# Altium schematic sheet Sheet2.SchDoc
size A4
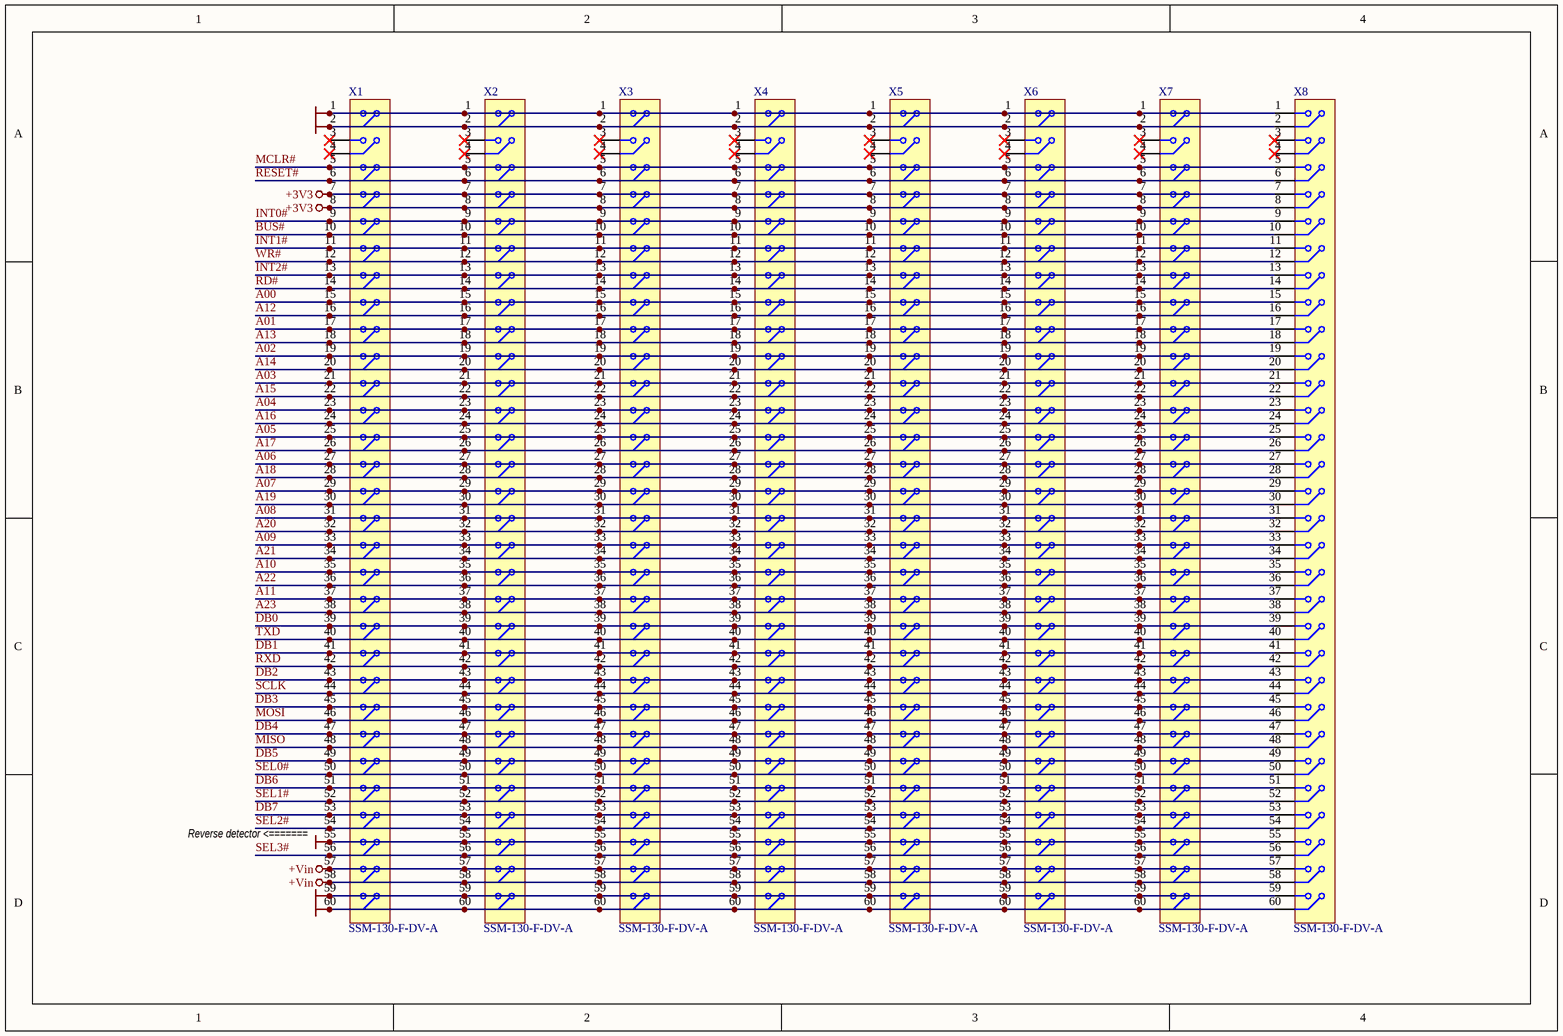
[diagram p0: Sheet2.SchDoc]

## Parts
X1  SSM-130-F-DV-A  [2015-2X30XD]
X2  SSM-130-F-DV-A  [2015-2X30XD]
X3  SSM-130-F-DV-A  [2015-2X30XD]
X4  SSM-130-F-DV-A  [2015-2X30XD]
X5  SSM-130-F-DV-A  [2015-2X30XD]
X6  SSM-130-F-DV-A  [2015-2X30XD]
X7  SSM-130-F-DV-A  [2015-2X30XD]
X8  SSM-130-F-DV-A  [2015-2X30XD]

## Nets
+3V3: X1.7 X1.8 X2.7 X2.8 X3.7 X3.8 X4.7 X4.8 X5.7 X5.8 X6.7 X6.8 X7.7 X7.8 X8.7 X8.8
+Vin: X1.57 X1.58 X2.57 X2.58 X3.57 X3.58 X4.57 X4.58 X5.57 X5.58 X6.57 X6.58 X7.57 X7.58 X8.57 X8.58
GND: X1.1 X1.2 X1.55 X1.59 X1.60 X2.1 X2.2 X2.55 X2.59 X2.60 X3.1 X3.2 X3.55 X3.59 X3.60 X4.1 X4.2 X4.55 X4.59 X4.60 X5.1 X5.2 X5.55 X5.59 X5.60 X6.1 X6.2 X6.55 X6.59 X6.60 X7.1 X7.2 X7.55 X7.59 X7.60 X8.1 X8.2 X8.55 X8.59 X8.60
A00: X1.15 X2.15 X3.15 X4.15 X5.15 X6.15 X7.15 X8.15
A01: X1.17 X2.17 X3.17 X4.17 X5.17 X6.17 X7.17 X8.17
A02: X1.19 X2.19 X3.19 X4.19 X5.19 X6.19 X7.19 X8.19
A03: X1.21 X2.21 X3.21 X4.21 X5.21 X6.21 X7.21 X8.21
A04: X1.23 X2.23 X3.23 X4.23 X5.23 X6.23 X7.23 X8.23
A05: X1.25 X2.25 X3.25 X4.25 X5.25 X6.25 X7.25 X8.25
A06: X1.27 X2.27 X3.27 X4.27 X5.27 X6.27 X7.27 X8.27
A07: X1.29 X2.29 X3.29 X4.29 X5.29 X6.29 X7.29 X8.29
A08: X1.31 X2.31 X3.31 X4.31 X5.31 X6.31 X7.31 X8.31
A09: X1.33 X2.33 X3.33 X4.33 X5.33 X6.33 X7.33 X8.33
A10: X1.35 X2.35 X3.35 X4.35 X5.35 X6.35 X7.35 X8.35
A11: X1.37 X2.37 X3.37 X4.37 X5.37 X6.37 X7.37 X8.37
A12: X1.16 X2.16 X3.16 X4.16 X5.16 X6.16 X7.16 X8.16
A13: X1.18 X2.18 X3.18 X4.18 X5.18 X6.18 X7.18 X8.18
A14: X1.20 X2.20 X3.20 X4.20 X5.20 X6.20 X7.20 X8.20
A15: X1.22 X2.22 X3.22 X4.22 X5.22 X6.22 X7.22 X8.22
A16: X1.24 X2.24 X3.24 X4.24 X5.24 X6.24 X7.24 X8.24
A17: X1.26 X2.26 X3.26 X4.26 X5.26 X6.26 X7.26 X8.26
A18: X1.28 X2.28 X3.28 X4.28 X5.28 X6.28 X7.28 X8.28
A19: X1.30 X2.30 X3.30 X4.30 X5.30 X6.30 X7.30 X8.30
A20: X1.32 X2.32 X3.32 X4.32 X5.32 X6.32 X7.32 X8.32
A21: X1.34 X2.34 X3.34 X4.34 X5.34 X6.34 X7.34 X8.34
A22: X1.36 X2.36 X3.36 X4.36 X5.36 X6.36 X7.36 X8.36
A23: X1.38 X2.38 X3.38 X4.38 X5.38 X6.38 X7.38 X8.38
BUS#: X1.10 X2.10 X3.10 X4.10 X5.10 X6.10 X7.10 X8.10
DB0: X1.39 X2.39 X3.39 X4.39 X5.39 X6.39 X7.39 X8.39
DB1: X1.41 X2.41 X3.41 X4.41 X5.41 X6.41 X7.41 X8.41
DB2: X1.43 X2.43 X3.43 X4.43 X5.43 X6.43 X7.43 X8.43
DB3: X1.45 X2.45 X3.45 X4.45 X5.45 X6.45 X7.45 X8.45
DB4: X1.47 X2.47 X3.47 X4.47 X5.47 X6.47 X7.47 X8.47
DB5: X1.49 X2.49 X3.49 X4.49 X5.49 X6.49 X7.49 X8.49
DB6: X1.51 X2.51 X3.51 X4.51 X5.51 X6.51 X7.51 X8.51
DB7: X1.53 X2.53 X3.53 X4.53 X5.53 X6.53 X7.53 X8.53
INT0#: X1.9 X2.9 X3.9 X4.9 X5.9 X6.9 X7.9 X8.9
INT1#: X1.11 X2.11 X3.11 X4.11 X5.11 X6.11 X7.11 X8.11
INT2#: X1.13 X2.13 X3.13 X4.13 X5.13 X6.13 X7.13 X8.13
MCLR#: X1.5 X2.5 X3.5 X4.5 X5.5 X6.5 X7.5 X8.5
MISO: X1.48 X2.48 X3.48 X4.48 X5.48 X6.48 X7.48 X8.48
MOSI: X1.46 X2.46 X3.46 X4.46 X5.46 X6.46 X7.46 X8.46
RD#: X1.14 X2.14 X3.14 X4.14 X5.14 X6.14 X7.14 X8.14
RESET#: X1.6 X2.6 X3.6 X4.6 X5.6 X6.6 X7.6 X8.6
RXD: X1.42 X2.42 X3.42 X4.42 X5.42 X6.42 X7.42 X8.42
SCLK: X1.44 X2.44 X3.44 X4.44 X5.44 X6.44 X7.44 X8.44
SEL0#: X1.50 X2.50 X3.50 X4.50 X5.50 X6.50 X7.50 X8.50
SEL1#: X1.52 X2.52 X3.52 X4.52 X5.52 X6.52 X7.52 X8.52
SEL2#: X1.54 X2.54 X3.54 X4.54 X5.54 X6.54 X7.54 X8.54
SEL3#: X1.56 X2.56 X3.56 X4.56 X5.56 X6.56 X7.56 X8.56
TXD: X1.40 X2.40 X3.40 X4.40 X5.40 X6.40 X7.40 X8.40
WR#: X1.12 X2.12 X3.12 X4.12 X5.12 X6.12 X7.12 X8.12

Not connected (* = marked no-connect by the designer): X1 3* 4*; X2 3* 4*; X3 3* 4*; X4 3* 4*; X5 3* 4*; X6 3* 4*; X7 3* 4*; X8 3* 4*

## Notes on the sheet
- (near X1) Reverse detector <=======

## Library data of the parts
X1-X8 = Connector 2x30: Dual row, 60-way connector